# Altium schematic sheet Sheet1.SchDoc
size A3
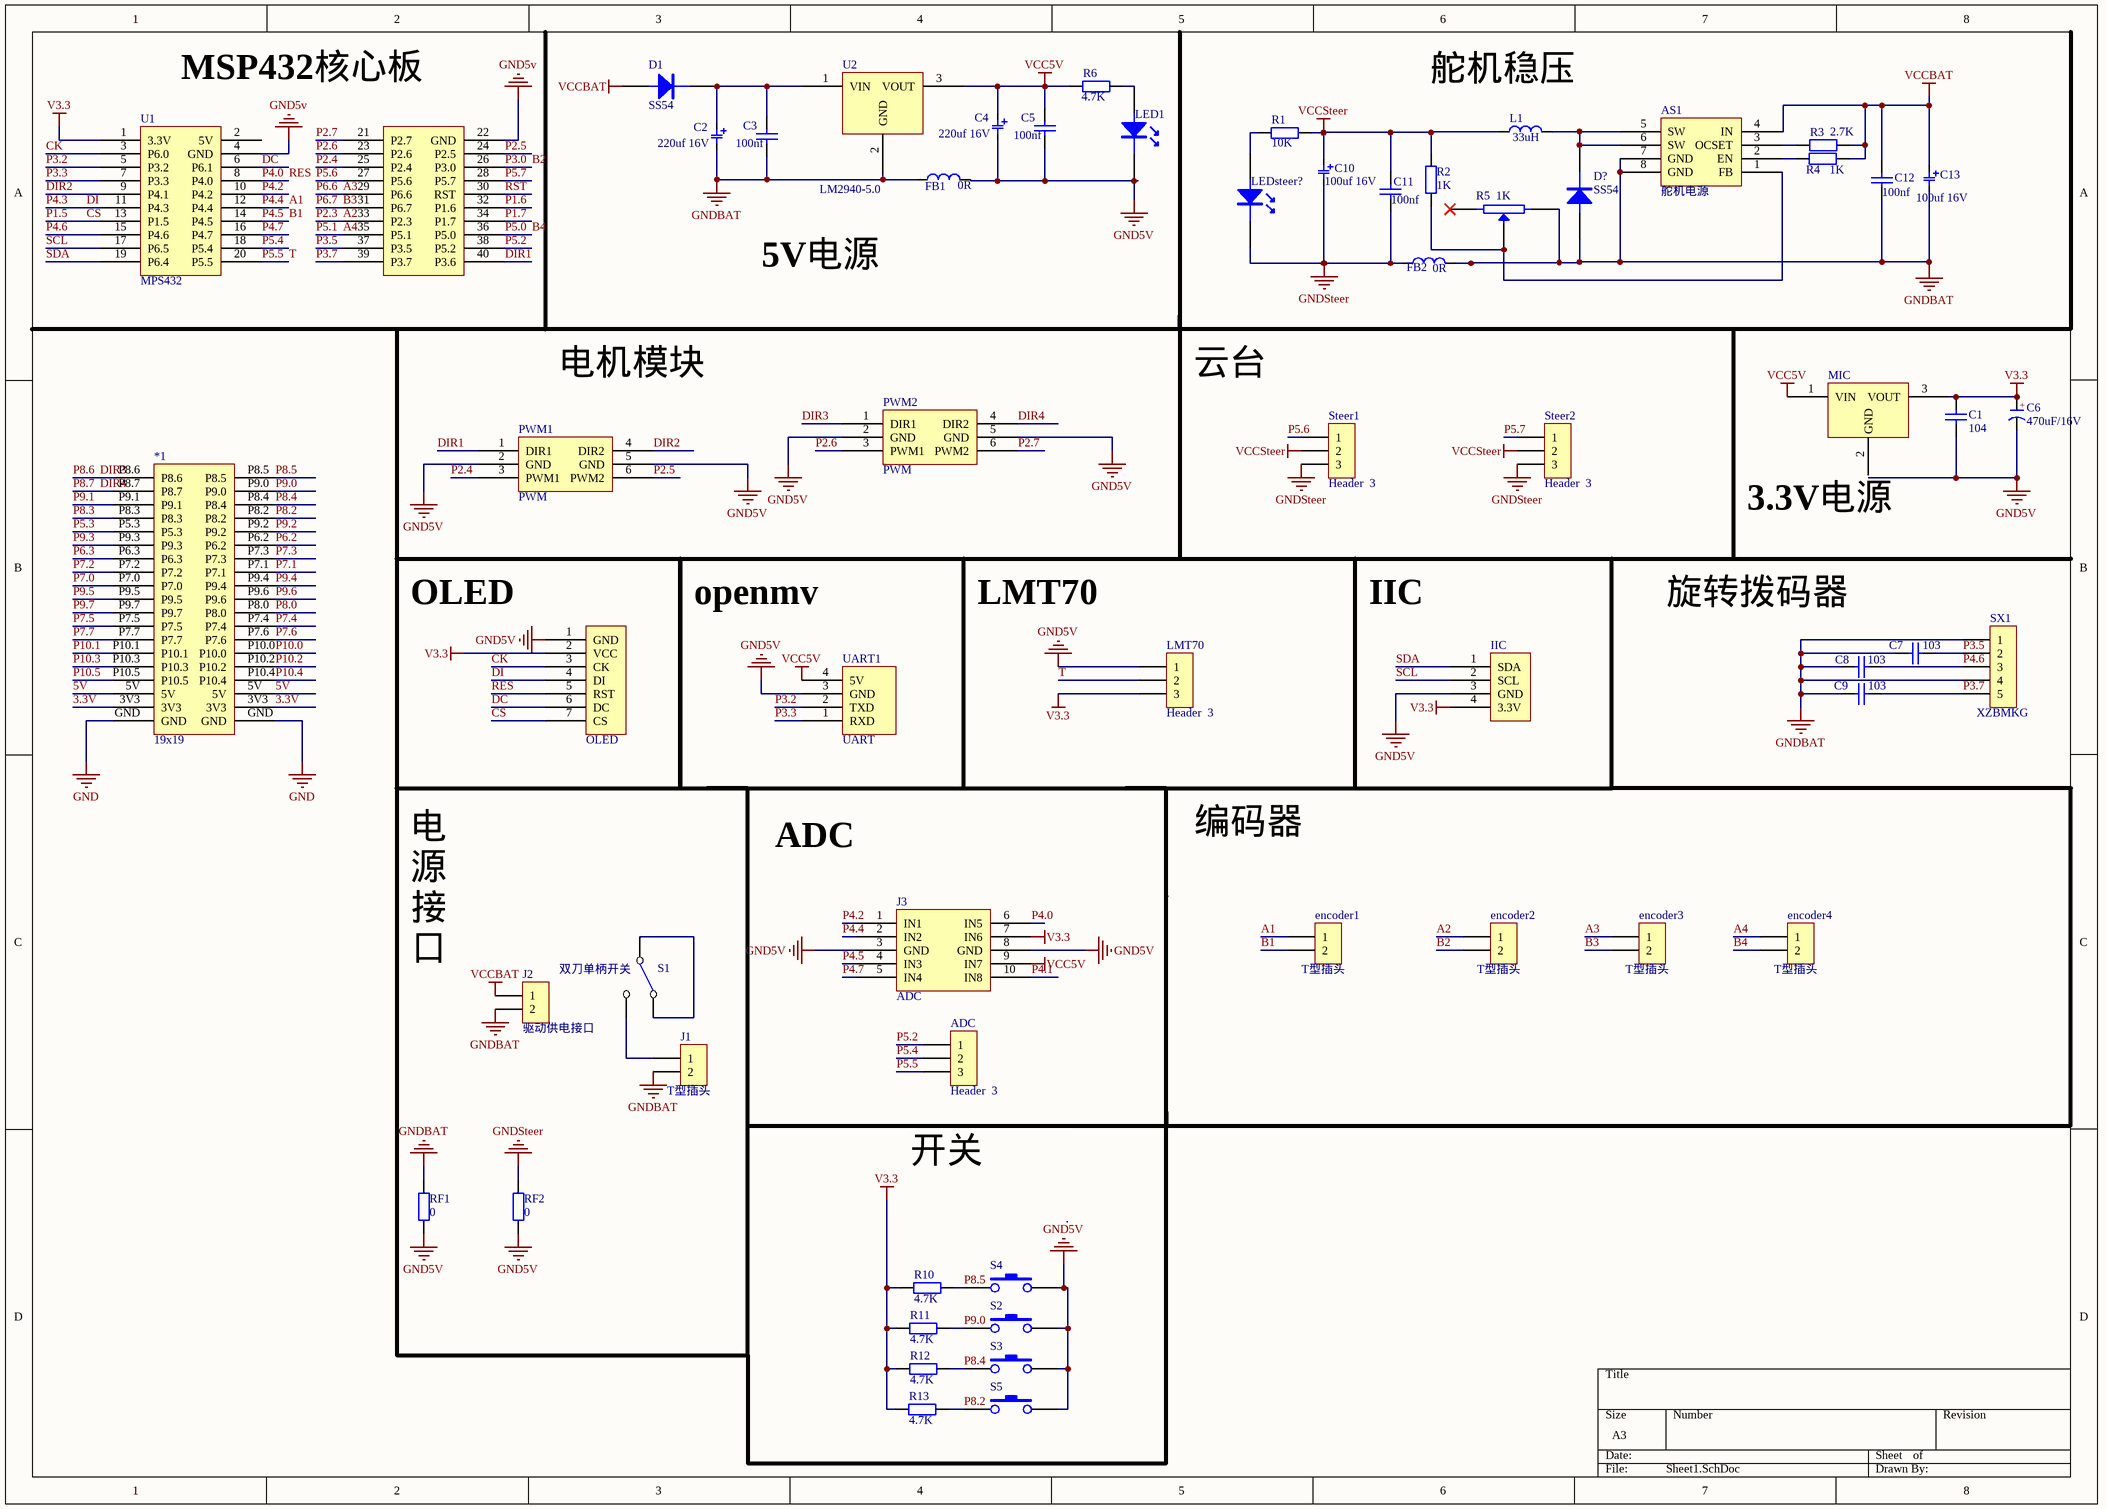
[diagram p0: Sheet1.SchDoc]

## Parts
*1  19x19
*?  OLED
ADC  Header  3  [SIP3]
AS1  舵机电源  [751-02_N]
C1  value 104  [0805C]  (hidden comment: Cap)
C2  220uf 16V  [Cap_SMD]
C3  value 100nf  [0805C]
C4  220uf 16V  [Cap_SMD]
C5  value 100nf  [0805C]
C6  470uF/16V  [220uf钽电容]
C7  103  [0805C]
C8  value 103  [0805C]  (hidden comment: 104)
C9  value 103  [0805C]  (hidden comment: 104)
C10  100uf 16V  [Cap_SMD]
C11  100nf  [0805C]
C12  100nf  [0805C]
C13  100uf 16V  [Cap_SMD]
D1  SS54  [7227]
D?  SS54  [7227]
encoder1  T型插头  [DG1282-5.0]
encoder2  T型插头  [DG1282-5.0]
encoder3  T型插头  [DG1282-5.0]
encoder4  T型插头  [DG1282-5.0]
FB1  0R  [R0805]
FB2  0R  [R0805]
IIC  (no value)
J1  T型插头  [DG1282-5.0]
J2  驱动供电接口  [DG1282-5.0]
J3  ADC
L1  33uH  [L-SMD-0630]
LED1  LED5V  [LED 0805B]  (value not drawn)
LEDsteer?  LEDs  [LED 0805B]  (value not drawn)
LMT70  Header  3  [SIP3]
MIC  39100  [SOT-223   AMS1117]  (value not drawn)
PWM1  PWM
PWM2  PWM
R1  value 10K  [R 0805]
R2  1K  [R 0805]
R3  2.7K  [R 0805]
R4  1K  [R 0805]
R5  1K  [3296W]
R6  value 4.7K  [R 0805]
R10  4.7K  [R 0805]
R11  4.7K  [R 0805]
R12  4.7K  [R 0805]
R13  4.7K  [R 0805]
RF1  0  [R 0805]
RF2  0  [R 0805]
S1  双刀单柄开关  [纽子开关]
S2  微动开关  [button_2pin]  (value not drawn)
S3  微动开关  [button_2pin]  (value not drawn)
S4  微动开关  [button_2pin]  (value not drawn)
S5  微动开关  [button_2pin]  (value not drawn)
Steer1  Header  3  [SIP3]
Steer2  Header  3  [SIP3]
SX1  XZBMKG  [EC11]
U1  MPS432
U2  LM2940-5.0  [PCBComponent_1 - duplicate]
UART1  UART

## Nets
GND: *1.GND
GND5V: *?.1(GND) C1.1 C4.2 C5.1 C6.2(K) FB1.2 IIC.3(GND) J3.3(GND) J3.8(GND) LED1.1(A) LMT70.1 MIC.2(GND) PWM1.2(GND) PWM1.5(GND) PWM2.2(GND) PWM2.5(GND) RF1.1 RF2.1 S2.2 S3.2 S4.2 S5.2 U1.4(GND) U1.22(GND) UART1.3(GND)
GNDBAT: AS1.7(GND) AS1.8(GND) C2.2 C3.1 C7.1 C8.1 C9.1 C12.1 C13.2 D?.1(A) FB1.1 FB2.2 J1.2 J2.2 R5.1 RF1.2 SX1.1 SX1.4 U2.2(GND)
GNDSteer: C10.2 C11.1 FB2.1 LEDsteer?.1(A) RF2.2 Steer1.3 Steer2.3
V3.3: *?.2(VCC) C1.2 C6.1(A) IIC.4(3.3V) J3.7(IN6) LMT70.3 MIC.3(VOUT) R10.1 R11.1 R12.1 R13.1 U1.1(3.3V)
VCC5V: C4.1 C5.2 J3.9(IN7) MIC.1(VIN) R6.2 U2.3(VOUT) UART1.4(5V)
VCCBAT: AS1.4(IN) C12.2 C13.1 D1.1(A) J2.1 R3.1 R4.1
VCCSteer: C10.1 C11.2 L1.1 R1.1 R2.1 Steer1.2 Steer2.2
3.3V: *1.3V3
5V: *1.5V
A1: encoder1.1 J3.2(IN2) U1.12(P4.4)  [also labelled P4.4]
A2: encoder2.1 U1.33(P2.3)  [also labelled P2.3]
A3: encoder3.1 U1.29(P6.6)  [also labelled P6.6]
A4: encoder4.1 U1.35(P5.1)  [also labelled P5.1]
B1: encoder1.2 J3.4(IN3) U1.14(P4.5)  [also labelled P4.5]
B2: encoder2.2 U1.26(P3.0)  [also labelled P3.0]
B3: encoder3.2 U1.31(P6.7)  [also labelled P6.7]
B4: encoder4.2 U1.36(P5.0)  [also labelled P5.0]
CK: *?.3(CK) U1.3(P6.0)
CS: *?.7(CS) U1.13(P1.5)  [also labelled P1.5]
DC: *?.6(DC) U1.6(P6.1)
DI: *?.4(DI) U1.11(P4.3)  [also labelled P4.3]
DIR1: PWM1.1(DIR1) U1.40(P3.6)
DIR2: PWM1.4(DIR2) U1.9(P4.1)
DIR3: *1.P8.6 PWM2.1(DIR1)  [also labelled P8.6]
DIR4: *1.P8.7 PWM2.4(DIR2)  [also labelled P8.7]
P1.6: U1.32(P1.6)
P1.7: U1.34(P1.7)
P2.4: PWM1.3(PWM1) U1.25(P2.4)
P2.5: PWM1.6(PWM2) U1.24(P2.5)
P2.6: PWM2.3(PWM1) U1.23(P2.6)
P2.7: PWM2.6(PWM2) U1.21(P2.7)
P3.2: U1.5(P3.2) UART1.2(TXD)
P3.3: U1.7(P3.3) UART1.1(RXD)
P3.5: C7.2 SX1.2 U1.37(P3.5)
P3.7: C9.2 SX1.5 U1.39(P3.7)
P4.0: *?.5(RST) J3.6(IN5) U1.8(P4.0)  [also labelled RES]
P4.1: J3.10(IN8)
P4.2: J3.1(IN1) U1.10(P4.2)
P4.6: C8.2 SX1.3 U1.15(P4.6)
P4.7: J3.5(IN4) U1.16(P4.7)
P5.2: ADC.1 U1.38(P5.2)
P5.3: *1.P5.3
P5.4: ADC.2 U1.18(P5.4)
P5.5: ADC.3 LMT70.2 U1.20(P5.5)  [also labelled T]
P5.6: Steer1.1 U1.27(P5.6)
P5.7: Steer2.1 U1.28(P5.7)
P6.2: *1.P6.2
P6.3: *1.P6.3
P7.0: *1.P7.0
P7.1: *1.P7.1
P7.2: *1.P7.2
P7.3: *1.P7.3
P7.4: *1.P7.4
P7.5: *1.P7.5
P7.6: *1.P7.6
P7.7: *1.P7.7
P8.0: *1.P8.0
P8.2: *1.P8.2 R13.2 S5.1
P8.3: *1.P8.3
P8.4: *1.P8.4 R12.2 S3.1
P8.5: *1.P8.5 R10.2 S4.1
P9.0: *1.P9.0 R11.2 S2.1
P9.1: *1.P9.1
P9.2: *1.P9.2
P9.3: *1.P9.3
P9.4: *1.P9.4
P9.5: *1.P9.5
P9.6: *1.P9.6
P9.7: *1.P9.7
P10.0: *1.P10.0
P10.1: *1.P10.1
P10.2: *1.P10.2
P10.3: *1.P10.3
P10.4: *1.P10.4
P10.5: *1.P10.5
RST: U1.30(RST)
SCL: IIC.2(SCL) U1.17(P6.5)
SDA: IIC.1(SDA) U1.19(P6.4)
NetAS1_1: AS1.1(FB) R2.2 R5.2
NetAS1_2: AS1.2(EN) R4.2
NetAS1_3: AS1.3(OCSET) R3.2
NetAS1_5: AS1.5(SW) AS1.6(SW) D?.2(K) L1.2
NetC2_1: C2.1 C3.2 D1.2(K) U2.1(VIN)
NetJ1_1: J1.1 S1.3(NO)
NetLED1_2: LED1.2(K) R6.1
NetLEDsteer?_2: LEDsteer?.2(K) R1.2
NetS1_1: S1.1(NC) S1.2

Not connected (* = marked no-connect by the designer): R5 3(W)*; U1 2(__5V)

## Notes on the sheet
- MSP432核心板
- 舵机稳压
- 5V电源
- 电机模块
- (near Steer1) 云台
- 3.3V电源
- (near *?) OLED
- openmv
- LMT70
- IIC
- 旋转拨码器
- ADC
- 编码器
- 电源接口
- 开关
- (in symbol C-CD) +

## Library data of the parts
ADC LMT70 Steer1 Steer2 = CON3
C1 C3 C5 C7-C9 C11 C12 = Cap: Capacitor; Published: 8-Jun-2000; LatestRevisionDate: 17-Jul-2002; LatestRevisionNote: Re-released for DXP Platform.; PackageReference: RAD-0.3; Publisher: Altium Limited; PackageDescription: Radial Cap, Thru-Hole; 2 Leads; 0.3 in Pin Spacing
  C7: Value: 103
C2 C4 C10 C13 = ECAP
C6 = C-CD: 贴片钽电容; 版权归属: 源创客; BOM名称: 贴片钽电容; 学习资源: www.ooocke.com
D1 D? = 光敏二极管: Photosensitive Diode
encoder1-encoder4 J1 J2 = CON2
FB1 FB2 L1 = INDUCTANCE
IIC = PIN4
LED1 LEDsteer? = 发光二极管
R1-R4 R6 R10-R13 RF1 RF2 = Res2: Resistor; Published: 8-Jun-2000; LatestRevisionDate: 17-Jul-2002; LatestRevisionNote: Re-released for DXP Platform.; PackageReference: AXIAL-0.4; Publisher: Altium Limited; PackageDescription: Axial Device, Thru-Hole; 2 Leads; 0.4 in Pin Spacing
R5 = RESVR: Potentiometer
SX1 = CON5: Connector
U1 = Component_1_1